# EAGLE design Stepper-Driver (EAGLE 7.2.0)
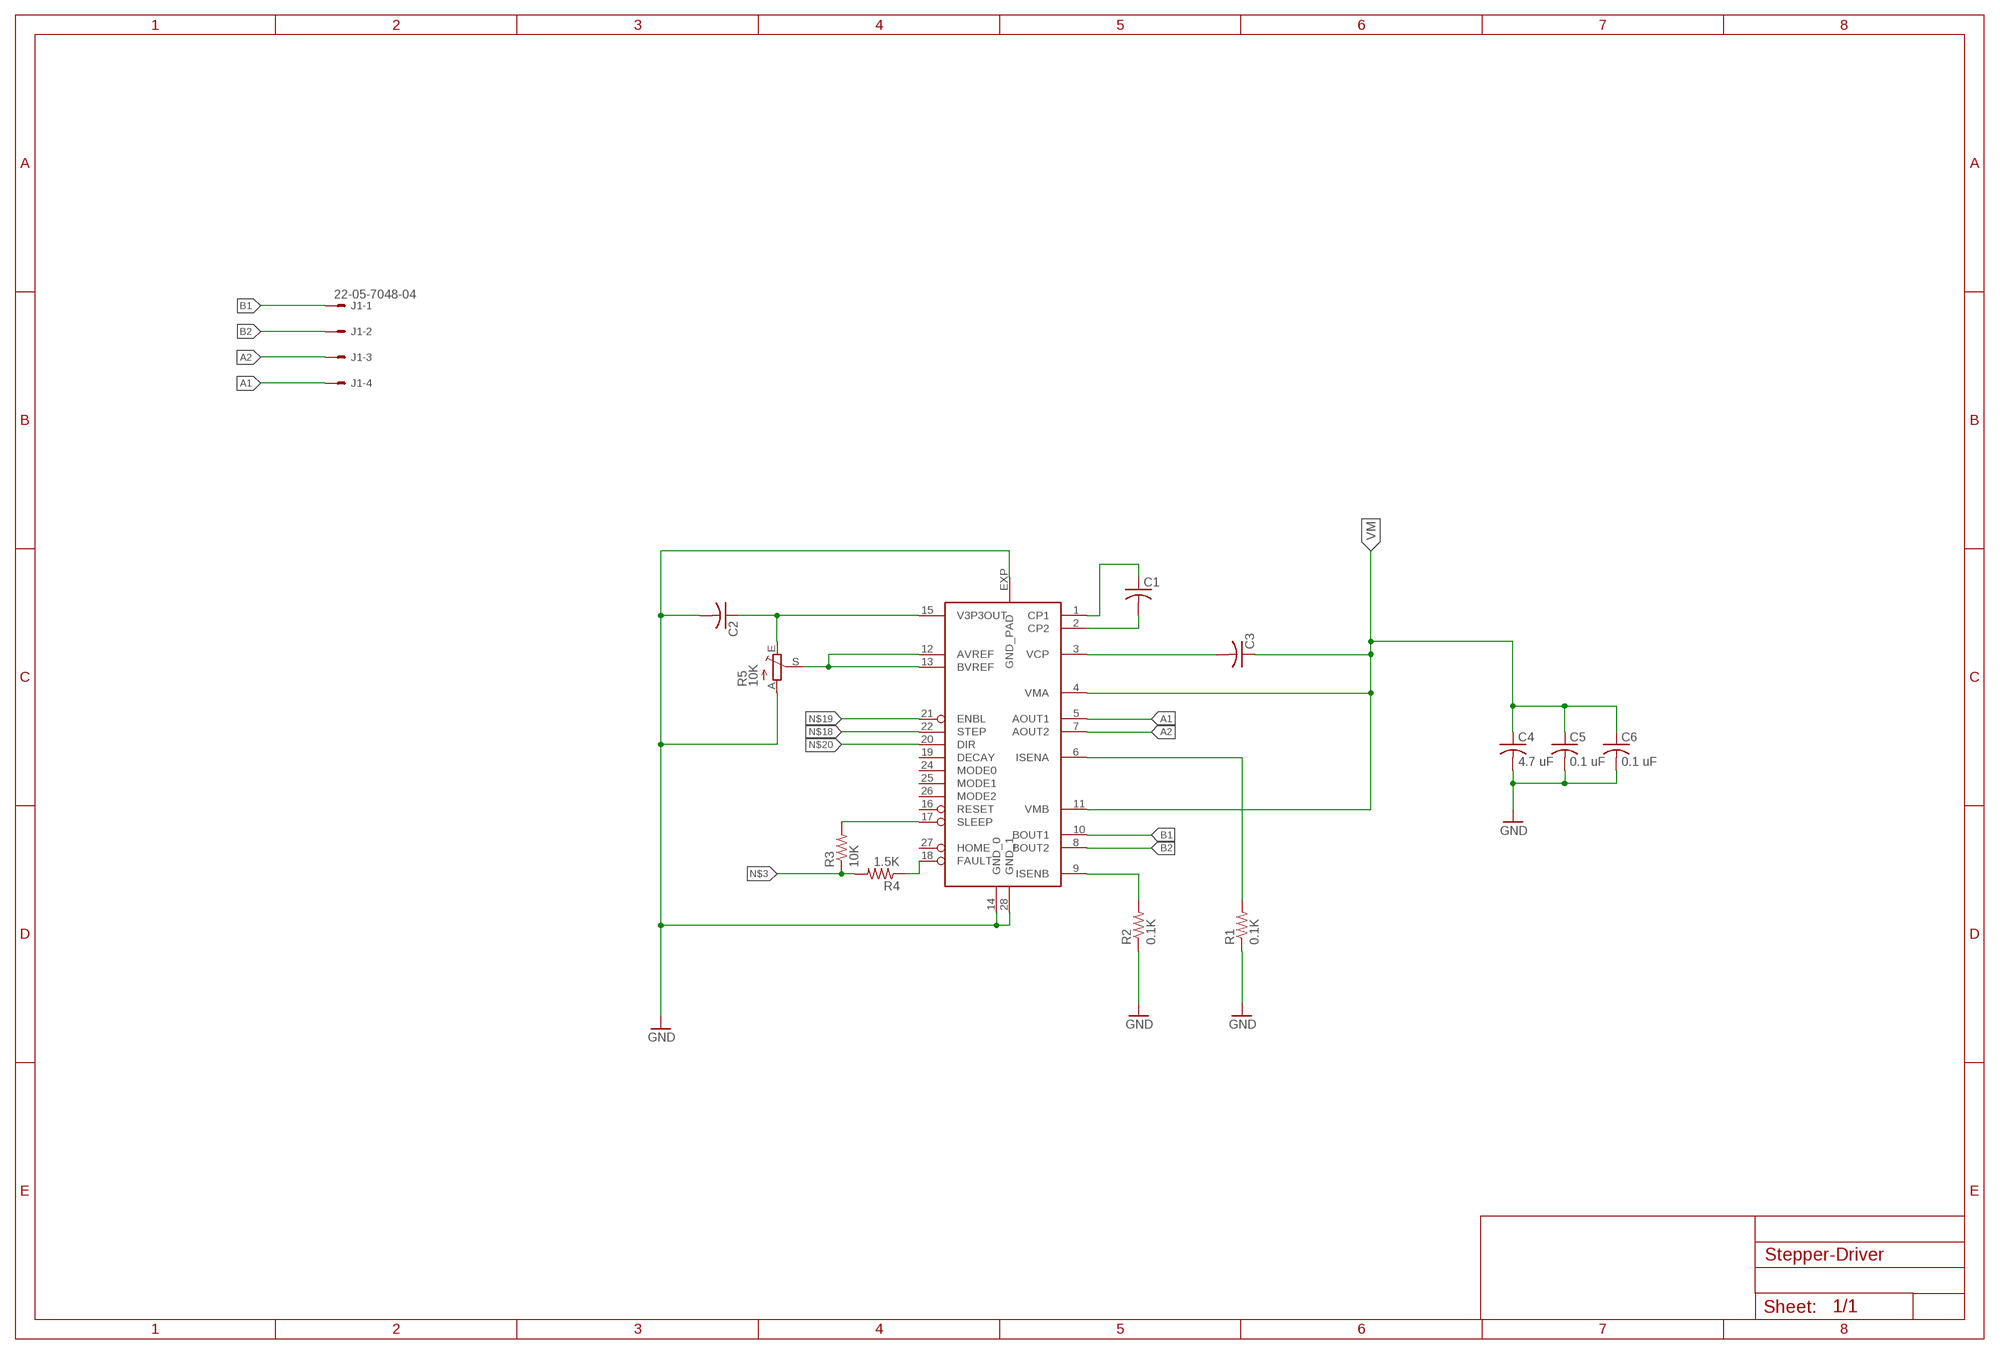
[diagram p0: schematic, sheet 1]

## Parts
C1  C-USC0805  [C0805]
C2  C-USC0805  [C0805]
C3  C-USC0805  [C0805]
C4  4.7 uF  C-USC0805  [C0805]
C5  0.1 uF  C-USC0805  [C0805]
C6  0.1 uF  C-USC0805  [C0805]
J1  22-05-7048-04  [7395-04]
R1  0.1K  R-US_R0805  [R0805]
R2  0.1K  R-US_R0805  [R0805]
R3  10K  R-US_R0805  [R0805]
R4  1.5K  R-US_R0805  [R0805]
R5  10K  TRIM_EU-CT6  [CT6]
U$1  DRV8825PWP  [TSSOP-28]

## Nets
A1: J1.4 U$1.5(AOUT1)
A2: J1.3 U$1.7(AOUT2)
B1: J1.1 U$1.10(BOUT1)
B2: J1.2 U$1.8(BOUT2)
GND: C2.2 C4.2 C5.2 C6.2 R1.1 R2.1 R5.A U$1.14(GND_0) U$1.28(GND_1) U$1.EXP(GND_PAD)
N$1: C3.2 U$1.3(VCP)
N$2: R4.1 U$1.18(FAULT)
N$3: R3.1 R4.2
N$4: R3.2 U$1.17(SLEEP)
N$9: R1.2 U$1.6(ISENA)
N$10: R2.2 U$1.9(ISENB)
N$11: R5.S U$1.12(AVREF) U$1.13(BVREF)
N$15: C2.1 R5.E U$1.15(V3P3OUT)
N$16: C1.1 U$1.1(CP1)
N$17: C1.2 U$1.2(CP2)
N$18: U$1.22(STEP)
N$19: U$1.21(ENBL)
N$20: U$1.20(DIR)
VM: C3.1 C4.1 C5.1 C6.1 U$1.4(VMA) U$1.11(VMB)
Unconnected: U$1.16(RESET) U$1.19(DECAY) U$1.24(MODE0) U$1.25(MODE1) U$1.26(MODE2) U$1.27(HOME)

## Library data of the parts
C1-C6 = rcl:C-US: CAPACITOR, American symbol
J1 = Son_of_Dark_Power:22-?-04: CONNECTOR wire to board 2.54 mm (.1 inch) pitch header; OC_FARNELL: unknown; OC_NEWARK: unknown
R1-R4 = rcl:R-US_: RESISTOR, American symbol
R5 = pot:TRIM_EU-: POTENTIOMETER
U$1 = drv88xx:DRV8825PWP

## Board
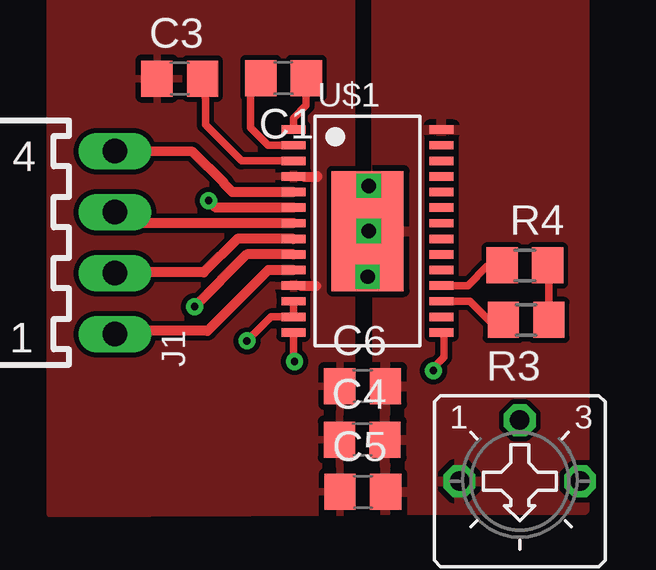
[diagram p1: board, top side]
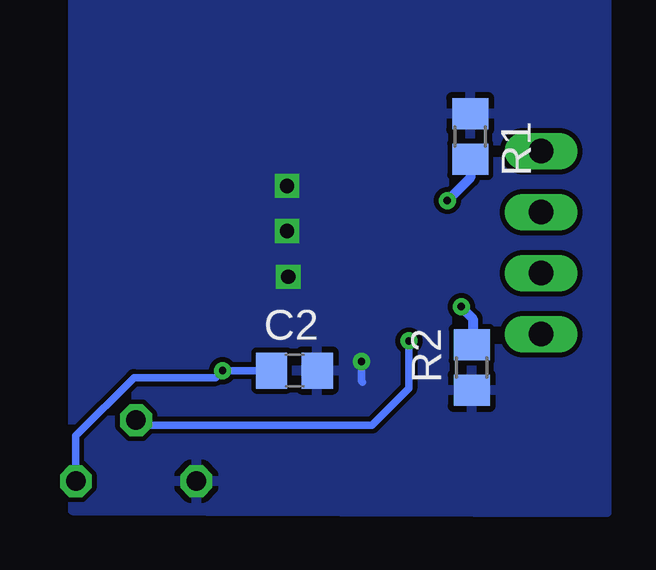
[diagram p2: board, bottom side, seen from below]

No outline drawn. Coordinates in mm, seen from the top.
Copper layers (1*16): Top 0.035mm / dielectric 1.5mm / Bottom 0.035mm
Design rules "default": minimum track width 10mil, minimum drill 24mil, track to track 8mil, track to pad 8mil, pad to pad 8mil, via to via 8mil, smd to smd 8mil, copper to edge 40mil, drill to drill 8mil, minimum pad ring 10mil, minimum via ring 8mil, stop-mask expansion 4mil, vias tented up to drill 0mil, thermal gap 10mil

### Footprints (pad centres in the part's own frame; a part is rotated, then mirrored left to right if it is on the bottom)
C0805 = smd 1.3 x 1.5: 1 -0.95,0; 2 0.95,0
7395-04 = drill 1.016 long: 1 3.81,0; 2 1.27,0; 3 -1.27,0; 4 -3.81,0
R0805 = smd 1.3 x 1.5: 1 -0.95,0; 2 0.95,0
CT6 = drill 0.813 octagon: A 2.515,0; E -2.515,0; S 0,-2.54
TSSOP-28 = smd 0.35 x 1: 1 -4.225,-3.087; 2 -3.575,-3.087; 3 -2.925,-3.087; 4 -2.275,-3.087; 5 -1.625,-3.087; 6 -0.975,-3.087; 7 -0.325,-3.087; 8 0.325,-3.087; 9 0.975,-3.087; 10 1.625,-3.087; 11 2.275,-3.087; 12 2.925,-3.087; 13 3.575,-3.087; 14 4.225,-3.087; 15 4.225,3.087; 16 3.575,3.087; 17 2.925,3.087; 18 2.275,3.087; 19 1.625,3.087; 20 0.975,3.087; 21 0.325,3.087; 22 -0.325,3.087; 23 -0.975,3.087; 24 -1.625,3.087; 25 -2.275,3.087; 26 -2.925,3.087; 27 -3.575,3.087; 28 -4.225,3.087 | smd 5 x 3: EXP 0,0

### Placement (x,y rotation side)
C1  22.81,22.63 180 top
C2  26.06,10.44 0 bottom
C3  18.49,22.6 0 top
C4  26.1,7.56 0 top
C5  26.12,5.38 0 top
C6  26.11,9.79 0 top
J1  15.78,15.77 270 top
R1  18.73,20.19 270 bottom
R2  18.67,10.56 90 bottom
R3  32.93,12.55 180 top
R4  32.88,14.82 0 top
R5  32.67,5.83 180 top
U$1  26.32,16.25 270 top

### Tracks (layer width: path | path; a pad name or v marks a point on that pad's centre or on a via)
A1
  Top 0.406: U$1.5 20.68,17.87 20.35,18.2 20.35,18.23 19.03,19.55 J1.4
A2
  Top 0.406: U$1.7 16.24,16.57 J1.3
B1
  Top 0.406: 15.8,11.98 J1.1 | 15.88,12.06 J1.1 | U$1.10 22.18,14.62 19.64,12.08 15.9,12.08 J1.1
B2
  Top 0.406: U$1.8 20.89,15.92 19.49,14.52 15.8,14.52 J1.2
GND  (via drill 0.3, 0.6)
  Top 0.305: 26.29,14.32 v26.32,14.34 | U$1.14 23.23,10.86 v23.27,10.81
  Bottom 0.305: v23.27,10.81 23.27,10 23.22,9.95
  other vias: 26.37,18.13 26.37,16.25
  pour Bottom: 13.04,25.95 35.31,26.03 35.31,4.62 13.04,4.54
  pour Top: 26.73,16.25 26.7,16.25 26.7,26 35.36,26 35.36,4.62 26.73,4.62
N$1
  Top 0.305: U$1.3 21.06,19.17 19.56,20.67 19.56,21.71 C3.2
N$2
  Top 0.305: U$1.18 30.5,13.97 31.3,14.78 31.89,14.78 R4.1
N$3
  Top 0.305: R3.1 33.88,14.77 R4.2
N$4
  Top 0.305: U$1.17 30.59,13.32 31.4,12.52 31.94,12.52 R3.2
N$9  (via drill 0.3)
  Top 0.406: U$1.6 19.98,17.22 v19.69,17.52
  Bottom 0.406: R1.2 18.73,18.48 v19.69,17.52
N$10  (via drill 0.3)
  Top 0.406: U$1.9 21.28,15.27 v19.11,13.1
  Bottom 0.406: v19.11,13.1 19.11,13.07 18.62,12.59 18.62,11.55 R2.2
N$11  (via drill 0.3)
  Top 0.305: U$1.12 U$1.13 22.29,12.67 v21.29,11.67
  Bottom 0.305: v21.29,11.67 21.29,9.69 22.82,8.16 32.46,8.16 R5.S
N$15  (via drill 0.3)
  Top 0.305: v29.06,10.43 29.06,10.56 29.49,10.99 29.49,11.94 U$1.15
  Bottom 0.305: R5.E 35.18,7.71 32.75,10.14 29.36,10.14 v29.06,10.43 v29.06,10.44 C2.1
N$16
  Top 0.305: U$1.1 23.23,20.96 23.75,21.48 23.75,22.61 C1.1
N$17
  Top 0.305: 21.93,22.57 C1.2 21.44,22.2 21.44,20.54 22.16,19.82 U$1.2
VM
  Top 0.406: 23.55,13.96 24.19,13.96 | 23.7,18.51 24.21,18.51 24.21,18.54
  pour Top: 25.66,4.54 25.66,26.16 13.09,26.08 13.09,4.46